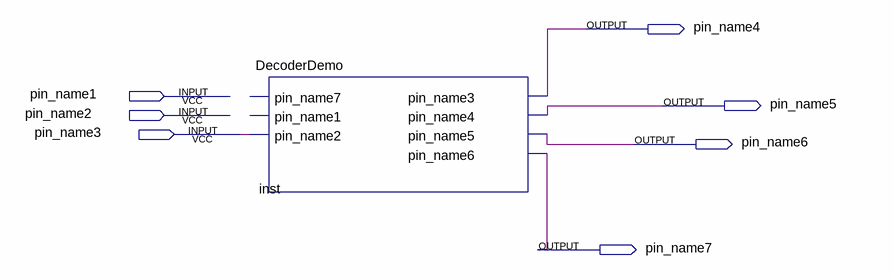
[diagram p0: schematic sheet]
// Quartus schematic Decoderdemo2.bdf as structural Verilog: 1 symbols, 7 pins
module Decoderdemo2 (
  input  pin_name1,
  input  pin_name2,
  input  pin_name3,
  output pin_name4,
  output pin_name5,
  output pin_name6,
  output pin_name7
);

  DecoderDemo inst (
    .pin_name2(pin_name3), .pin_name3(pin_name4), .pin_name4(pin_name5), .pin_name5(pin_name6),
    .pin_name6(pin_name7));  // open: pin_name7, pin_name1
endmodule
